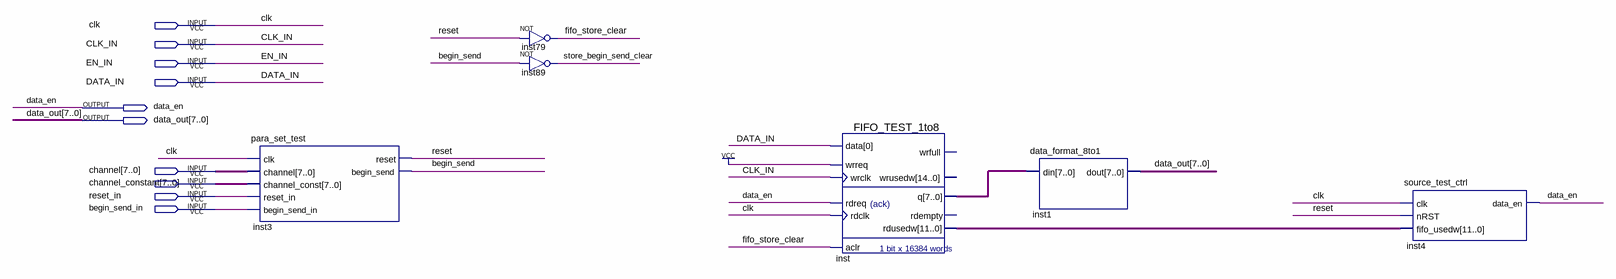
[diagram p0: schematic sheet]
// Quartus schematic source_test.bdf as structural Verilog: 6 symbols, 10 pins
module source_test (
  input  clk,
  input  CLK_IN,
  input  EN_IN,
  input  DATA_IN,
  input  [7:0] channel,
  input  [7:0] channel_constant,
  input  reset_in,
  input  begin_send_in,
  output data_en,
  output [7:0] data_out
);

  wire begin_send, fifo_store_clear, reset, store_begin_send_clear;
  wire [7:0] inst_q;
  wire [11:0] inst_rdusedw;

  para_set_test inst3 (
    .clk(clk), .channel(channel), .channel_const(channel_constant), .reset_in(reset_in),
    .begin_send_in(begin_send_in), .reset(reset), .begin_send(begin_send));
  not inst79 (fifo_store_clear, reset);
  not inst89 (store_begin_send_clear, begin_send);
  FIFO_TEST_1to8 inst (
    .data(DATA_IN), .wrreq(1'b1), .wrclk(CLK_IN), .rdreq(data_en), .rdclk(clk), .aclr(fifo_store_clear),
    .q(inst_q), .rdusedw(inst_rdusedw));  // open: wrfull, wrusedw, rdempty
  data_format_8to1 inst1 (.din(inst_q), .dout(data_out));
  source_test_ctrl inst4 (.clk(clk), .nRST(reset), .fifo_usedw(inst_rdusedw), .data_en(data_en));
endmodule
